# EAGLE design 04C-10 (EAGLE 6.3)
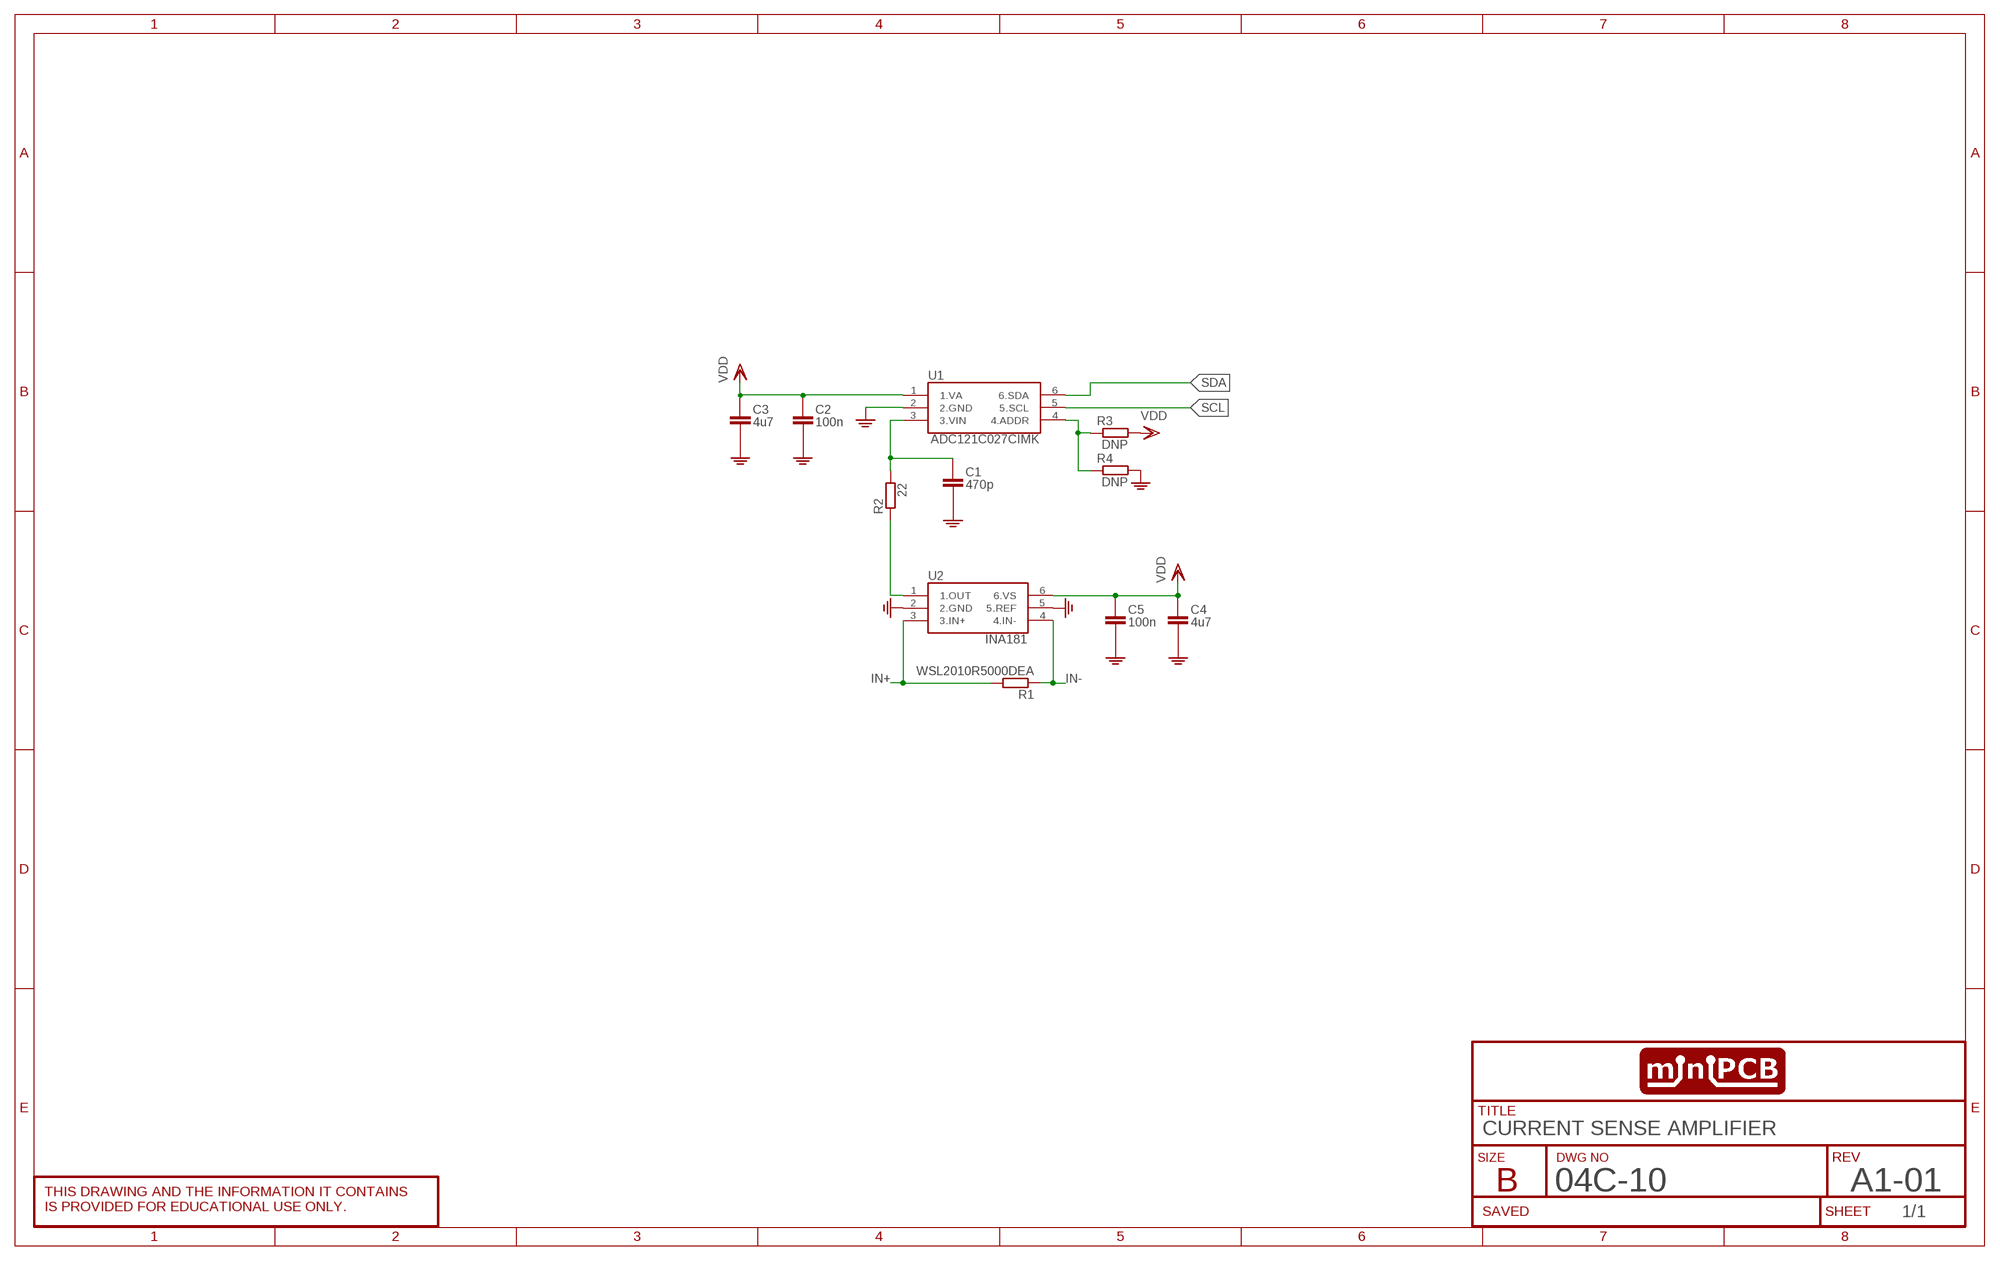
[diagram p0: schematic, sheet 1]
SHEET1 (SCHEMATIC): DWG_NO: 04C-10; REV: A1-01; TITLE: CURRENT SENSE AMPLIFIER

## Parts
C1  470p  CAPACITOR0402  [C0402]
C2  100n  CAPACITOR0402  [C0402]
C3  4u7  CAPACITOR0402  [C0402]
C4  4u7  CAPACITOR0402  [C0402]
C5  100n  CAPACITOR0402  [C0402]
R1  WSL2010R5000DEA  R-EU_R5025  [R5025]
R2  22  RESISTOR0402  [R0402]
R3  DNP  RESISTOR0402  [R0402]
R4  DNP  RESISTOR0402  [R0402]
U1  ADC121C027CIMK  [SOT23-6]
U2  INA181  INAX81  [SOT23-6]

## Nets
GND: C1.2(-) C2.2(-) C3.2(-) C4.2(-) C5.2(-) R4.2 U1.2(2.GND) U2.2(2.GND) U2.5(5.REF)
IN+: R1.2 U2.3(3.IN+)
IN-: R1.1 U2.4(4.IN-)
N$1: C1.1(+) R2.2 U1.3(3.VIN)
N$2: R2.1 U2.1(1.OUT)
N$3: R3.1 R4.1 U1.4(4.ADDR)
SCL: U1.5(5.SCL)
SDA: U1.6(6.SDA)
VDD: C2.1(+) C3.1(+) C4.1(+) C5.1(+) R3.2 U1.1(1.VA) U2.6(6.VS)

## Library data of the parts
C1-C5 = minipcb:CAPACITOR
R1 = utsa:R-EU_: RESISTOR, European symbol
R2-R4 = minipcb:RESISTOR
U1 = utsa:ADC121C027
U2 = utsa:INAX81: INAx181 Bidirectional, Low- and High-Side Voltage Output, Current-Sense Amplifier

## Board
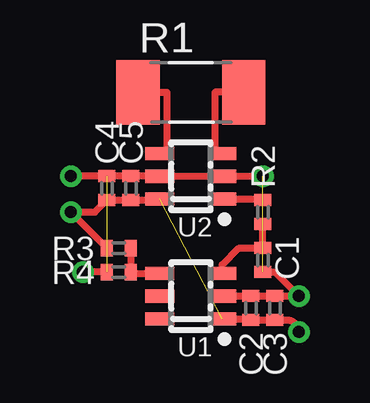
[diagram p1: board, top side]

No outline drawn. Coordinates in mm, seen from the top.
Copper layers (1*16): Top 0.035mm / dielectric 1.5mm / Bottom 0.035mm
Design rules "default": minimum track width 10mil, minimum drill 0.6mm, track to track 8mil, track to pad 8mil, pad to pad 8mil, via to via 8mil, smd to smd 8mil, copper to edge 40mil, drill to drill 8mil, minimum pad ring 10mil, minimum via ring 8mil, stop-mask expansion 4mil, vias tented up to drill 0mil, thermal gap 10mil

### Footprints (pad centres in the part's own frame; a part is rotated, then mirrored left to right if it is on the bottom)
C0402 = smd 0.5 x 0.7: 1 -0.5,0; 2 0.5,0
R5025 = smd 1.8 x 2.7: 1 -2.2,0; 2 2.2,0
R0402 = smd 0.5 x 0.7: 1 -0.5,0; 2 0.5,0
SOT23-6 = smd 0.55 x 1.2: 1 -0.95,-1.3; 2 0,-1.3; 3 0.95,-1.3; 4 0.95,1.3; 5 0,1.3; 6 -0.95,1.3

### Placement (x,y rotation side)
C1  3,-7 270 top
C2  2.5,-9 90 top
C3  3.5,-9 90 top
C4  -3.5,-4 90 top
C5  -2.5,-4 90 top
R1  0,0 0 top
R2  3,-5 270 top
R3  -3,-6.5 180 top
R4  -3,-7.5 180 top
U1  0,-8.5 90 top
U2  0,-3.5 90 top

### Tracks (layer width: path | path; a pad name or v marks a point on that pad's centre or on a via)
GND  (via drill 0.5)  (2 unrouted)
  Top 0.3: v3,-3.5 U2.2 U2.5 C5.2 C4.2 v-5,-3.5 | U1.2 C2.2 C3.2 v4.5,-8.5 3.5,-7.5 C1.2 | R4.2 v-4.5,-7.5
IN+
  Top 0.3: R1.2 1,0 1,-2.25 arc90 U2.3
IN-
  Top 0.3: R1.1 -1,0 -1,-2.25 arc-90 U2.4
N$1
  Top 0.3: U1.3 1.3,-7.2 2,-6.5 C1.1 R2.2
N$2
  Top 0.3: U2.1 2.95,-4.45 arc-90 R2.1
N$3
  Top 0.3: U1.4 -2.45,-7.55 R4.1 R3.1
VDD  (via drill 0.5)  (1 unrouted)
  Top 0.3: U1.1 2.45,-9.45 arc-90 C2.1 C3.1 4,-9.5 arc-90 v4.5,-10 | R3.2 v-5,-5 -4,-5 C4.1 C5.1 -1.35,-4.5 U2.6